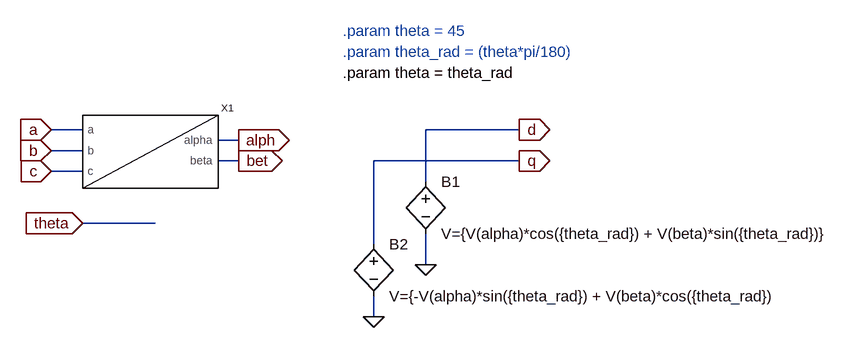
[diagram p0: schematic abc_to_dq.asc]
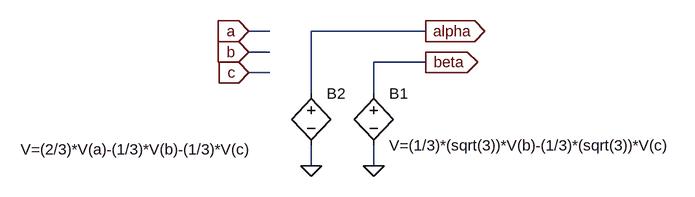
[diagram p1: sub-circuit abc_to_alphabeta.asc]
abc_to_dq.asc, the LTspice schematic file:
Version 4
SHEET 1 1312 680
WIRE 48 128 0 128
WIRE 720 128 576 128
WIRE 288 144 256 144
WIRE 48 160 0 160
WIRE 288 176 256 176
WIRE 720 176 496 176
WIRE 48 192 0 192
WIRE 576 208 576 128
WIRE 160 272 48 272
WIRE 496 304 496 176
WIRE 576 336 576 288
WIRE 496 416 496 384
FLAG 0 128 a
IOPIN 0 128 In
FLAG 0 160 b
IOPIN 0 160 In
FLAG 0 192 c
IOPIN 0 192 In
FLAG 288 176 bet
IOPIN 288 176 Out
FLAG 288 144 alph
IOPIN 288 144 Out
FLAG 576 336 0
FLAG 496 416 0
FLAG 720 128 d
IOPIN 720 128 Out
FLAG 720 176 q
IOPIN 720 176 Out
FLAG 48 272 theta
IOPIN 48 272 In
SYMBOL abc_to_alphabeta 112 160 R0
SYMATTR InstName X1
SYMBOL bv 576 192 R0
SYMATTR InstName B1
SYMATTR Value V={V(alpha)*cos({theta_rad}) + V(beta)*sin({theta_rad})}
SYMBOL bv 496 288 R0
SYMATTR InstName B2
SYMATTR Value V={-V(alpha)*sin({theta_rad}) + V(beta)*cos({theta_rad})
}
TEXT 448 -24 Left 2 ;.param theta = 45
TEXT 448 8 Left 2 ;.param theta_rad = (theta*pi/180)
TEXT 448 40 Left 2 !.param theta = theta_rad

abc_to_alphabeta.asc, the sub-circuit schematic file:
Version 4
SHEET 1 880 680
WIRE 32 96 0 96
WIRE 272 96 96 96
WIRE 32 128 0 128
WIRE 272 144 192 144
WIRE 32 160 0 160
WIRE 96 192 96 96
WIRE 192 192 192 144
WIRE 96 304 96 272
WIRE 192 304 192 272
FLAG 0 96 a
IOPIN 0 96 In
FLAG 0 128 b
IOPIN 0 128 In
FLAG 0 160 c
IOPIN 0 160 In
FLAG 272 96 alpha
IOPIN 272 96 Out
FLAG 272 144 beta
IOPIN 272 144 Out
FLAG 96 304 0
FLAG 192 304 0
SYMBOL bv 192 176 R0
SYMATTR InstName B1
SYMATTR Value V=(1/3)*(sqrt(3))*V(b)-(1/3)*(sqrt(3))*V(c)
SYMBOL bv 96 176 R0
WINDOW 3 -447 102 Left 2
SYMATTR InstName B2
SYMATTR Value V=(2/3)*V(a)-(1/3)*V(b)-(1/3)*V(c)

The netlist it stands for:
* abc_to_dq.asc
XX1 a b c alph bet abc_to_alphabeta
B1 d 0 V={V(alpha)*cos({theta_rad}) + V(beta)*sin({theta_rad})}
B2 q 0 V={-V(alpha)*sin({theta_rad}) + V(beta)*cos({theta_rad})

* block symbol definitions
.subckt abc_to_alphabeta a b c alpha beta
B1 beta 0 V=(1/3)*(sqrt(3))*V(b)-(1/3)*(sqrt(3))*V(c)
B2 alpha 0 V=(2/3)*V(a)-(1/3)*V(b)-(1/3)*V(c)
.ends abc_to_alphabeta

* .param theta = 45
* .param theta_rad = (theta*pi/180)
.param theta = theta_rad
.backanno
.end